# Altium schematic sheet Eth_Conn.SchDoc
size A4; Organization: Altium Limited; Address1: L3, 12a Rodborough Rd; Address2: Frenchs Forest; Address3: NSW; Address4: Australia 2086
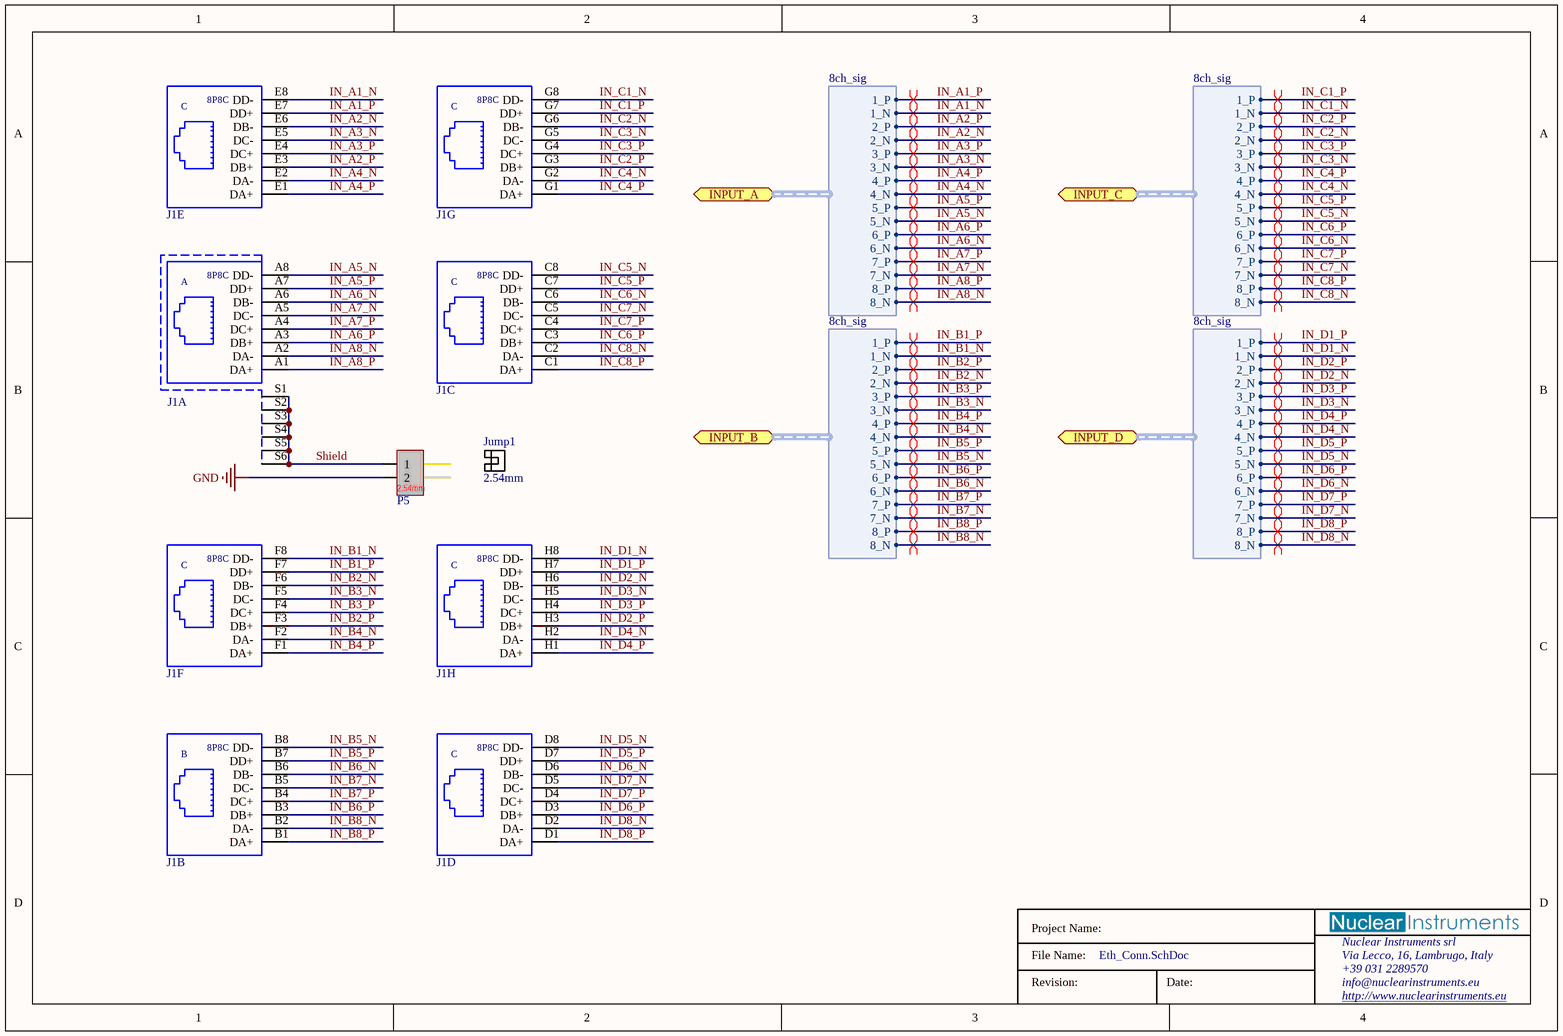
[diagram p0: Eth_Conn.SchDoc]

## Parts
J1  Wurth_WR-MJ_RJ45_2x4_615064243321  [Wurth_WR-MJ_RJ45_2x4_615064243321]  (value not drawn)  (parts A,B,C,D,E,F,G,H of 8)
Jump1  2.54mm  (mechanical)
P5  Wurth_WR-PHD_2way_2.54mm_male  [Wurth_WR-PHD_2way_2.54mm_male]  (value not drawn)

## Ports
INPUT_A (harness 8ch_sig), INPUT_B (harness 8ch_sig), INPUT_C (harness 8ch_sig), INPUT_D (harness 8ch_sig)

## Harnesses
8ch_sig: 1_P, 1_N, 2_P, 2_N, 3_P, 3_N, 4_P, 4_N, 5_P, 5_N, 6_P, 6_N, 7_P, 7_N, 8_P, 8_N

## Nets
GND: P5.2
IN_A1_N: J1.E8(DD-) ; port INPUT_A.1_N
IN_A1_P: J1.E7(DD+) ; port INPUT_A.1_P
IN_A2_N: J1.E6(DB-) ; port INPUT_A.2_N
IN_A2_P: J1.E3(DB+) ; port INPUT_A.2_P
IN_A3_N: J1.E5(DC-) ; port INPUT_A.3_N
IN_A3_P: J1.E4(DC+) ; port INPUT_A.3_P
IN_A4_N: J1.E2(DA-) ; port INPUT_A.4_N
IN_A4_P: J1.E1(DA+) ; port INPUT_A.4_P
IN_A5_N: J1.A8(DD-) ; port INPUT_A.5_N
IN_A5_P: J1.A7(DD+) ; port INPUT_A.5_P
IN_A6_N: J1.A6(DB-) ; port INPUT_A.6_N
IN_A6_P: J1.A3(DB+) ; port INPUT_A.6_P
IN_A7_N: J1.A5(DC-) ; port INPUT_A.7_N
IN_A7_P: J1.A4(DC+) ; port INPUT_A.7_P
IN_A8_N: J1.A2(DA-) ; port INPUT_A.8_N
IN_A8_P: J1.A1(DA+) ; port INPUT_A.8_P
IN_B1_N: J1.F8(DD-) ; port INPUT_B.1_N
IN_B1_P: J1.F7(DD+) ; port INPUT_B.1_P
IN_B2_N: J1.F6(DB-) ; port INPUT_B.2_N
IN_B2_P: J1.F3(DB+) ; port INPUT_B.2_P
IN_B3_N: J1.F5(DC-) ; port INPUT_B.3_N
IN_B3_P: J1.F4(DC+) ; port INPUT_B.3_P
IN_B4_N: J1.F2(DA-) ; port INPUT_B.4_N
IN_B4_P: J1.F1(DA+) ; port INPUT_B.4_P
IN_B5_N: J1.B8(DD-) ; port INPUT_B.5_N
IN_B5_P: J1.B7(DD+) ; port INPUT_B.5_P
IN_B6_N: J1.B6(DB-) ; port INPUT_B.6_N
IN_B6_P: J1.B3(DB+) ; port INPUT_B.6_P
IN_B7_N: J1.B5(DC-) ; port INPUT_B.7_N
IN_B7_P: J1.B4(DC+) ; port INPUT_B.7_P
IN_B8_N: J1.B2(DA-) ; port INPUT_B.8_N
IN_B8_P: J1.B1(DA+) ; port INPUT_B.8_P
IN_C1_N: J1.G8(DD-) ; port INPUT_C.1_N
IN_C1_P: J1.G7(DD+) ; port INPUT_C.1_P
IN_C2_N: J1.G6(DB-) ; port INPUT_C.2_N
IN_C2_P: J1.G3(DB+) ; port INPUT_C.2_P
IN_C3_N: J1.G5(DC-) ; port INPUT_C.3_N
IN_C3_P: J1.G4(DC+) ; port INPUT_C.3_P
IN_C4_N: J1.G2(DA-) ; port INPUT_C.4_N
IN_C4_P: J1.G1(DA+) ; port INPUT_C.4_P
IN_C5_N: J1.C8(DD-) ; port INPUT_C.5_N
IN_C5_P: J1.C7(DD+) ; port INPUT_C.5_P
IN_C6_N: J1.C6(DB-) ; port INPUT_C.6_N
IN_C6_P: J1.C3(DB+) ; port INPUT_C.6_P
IN_C7_N: J1.C5(DC-) ; port INPUT_C.7_N
IN_C7_P: J1.C4(DC+) ; port INPUT_C.7_P
IN_C8_N: J1.C2(DA-) ; port INPUT_C.8_N
IN_C8_P: J1.C1(DA+) ; port INPUT_C.8_P
IN_D1_N: J1.H8(DD-) ; port INPUT_D.1_N
IN_D1_P: J1.H7(DD+) ; port INPUT_D.1_P
IN_D2_N: J1.H6(DB-) ; port INPUT_D.2_N
IN_D2_P: J1.H3(DB+) ; port INPUT_D.2_P
IN_D3_N: J1.H5(DC-) ; port INPUT_D.3_N
IN_D3_P: J1.H4(DC+) ; port INPUT_D.3_P
IN_D4_N: J1.H2(DA-) ; port INPUT_D.4_N
IN_D4_P: J1.H1(DA+) ; port INPUT_D.4_P
IN_D5_N: J1.D8(DD-) ; port INPUT_D.5_N
IN_D5_P: J1.D7(DD+) ; port INPUT_D.5_P
IN_D6_N: J1.D6(DB-) ; port INPUT_D.6_N
IN_D6_P: J1.D3(DB+) ; port INPUT_D.6_P
IN_D7_N: J1.D5(DC-) ; port INPUT_D.7_N
IN_D7_P: J1.D4(DC+) ; port INPUT_D.7_P
IN_D8_N: J1.D2(DA-) ; port INPUT_D.8_N
IN_D8_P: J1.D1(DA+) ; port INPUT_D.8_P
Shield: J1.S1 J1.S2 J1.S3 J1.S4 J1.S5 J1.S6 P5.1

## Layout directives
differential pair: IN_A1_N, IN_A1_P, IN_A2_N, IN_A2_P, IN_A3_N, IN_A3_P, IN_A4_N, IN_A4_P, IN_A5_N, IN_A5_P, IN_A6_N, IN_A6_P, IN_A7_N, IN_A7_P, IN_A8_N, IN_A8_P, IN_B1_N, IN_B1_P, IN_B2_N, IN_B2_P, IN_B3_N, IN_B3_P, IN_B4_N, IN_B4_P, IN_B5_N, IN_B5_P, IN_B6_N, IN_B6_P, IN_B7_N, IN_B7_P, IN_B8_N, IN_B8_P, IN_C1_N, IN_C1_P, IN_C2_N, IN_C2_P, IN_C3_N, IN_C3_P, IN_C4_N, IN_C4_P, IN_C5_N, IN_C5_P, IN_C6_N, IN_C6_P, IN_C7_N, IN_C7_P, IN_C8_N, IN_C8_P, IN_D1_N, IN_D1_P, IN_D2_N, IN_D2_P, IN_D3_N, IN_D3_P, IN_D4_N, IN_D4_P, IN_D5_N, IN_D5_P, IN_D6_N, IN_D6_P, IN_D7_N, IN_D7_P, IN_D8_N, IN_D8_P

## Notes on the sheet
- Project Name:
- Revision:
- File Name:
- Date:
- Nuclear Instruments srl
- Via Lecco, 16, Lambrugo, Italy
- +39 031 2289570
- info@nuclearinstruments.eu
- http://www.nuclearinstruments.eu
- (in symbol Wurth_WR-MJ_RJ45_2x4_615064243321, part A) 8P8C; A
- (in symbol Wurth_WR-MJ_RJ45_2x4_615064243321, part B) 8P8C; B
- (in symbol Wurth_WR-MJ_RJ45_2x4_615064243321, part C) 8P8C; C
- (in symbol Wurth_WR-MJ_RJ45_2x4_615064243321, part D) 8P8C; C
- (in symbol Wurth_WR-MJ_RJ45_2x4_615064243321, part E) 8P8C; C
- (in symbol Wurth_WR-MJ_RJ45_2x4_615064243321, part F) 8P8C; C
- (in symbol Wurth_WR-MJ_RJ45_2x4_615064243321, part G) 8P8C; C
- (in symbol Wurth_WR-MJ_RJ45_2x4_615064243321, part H) 8P8C; C
- (in symbol Wurth_WR-PHD_2way_2.54mm_male) 2.54mm

## Library data of the parts
J1 = Wurth_WR-MJ_RJ45_2x4_615064243321: RJ45 Modular Jack 2x4; NICode: 00280001692; NIClass: Standard
Jump1 = SNT-100-BK-G: NICode: 01510000699; NIClass: Jumpers
P5 = Wurth_WR-PHD_2way_2.54mm_male: Male 2 way 2.54 mm; NICode: 00280000455; NIClass: Standard